# Altium schematic sheet debug_and_interface.SchDoc: Debugging / User Interface
size A4; DrawnBy: Juan I Carrano; DocumentNumber: 5; SheetNumber: 5; SheetTotal: 6
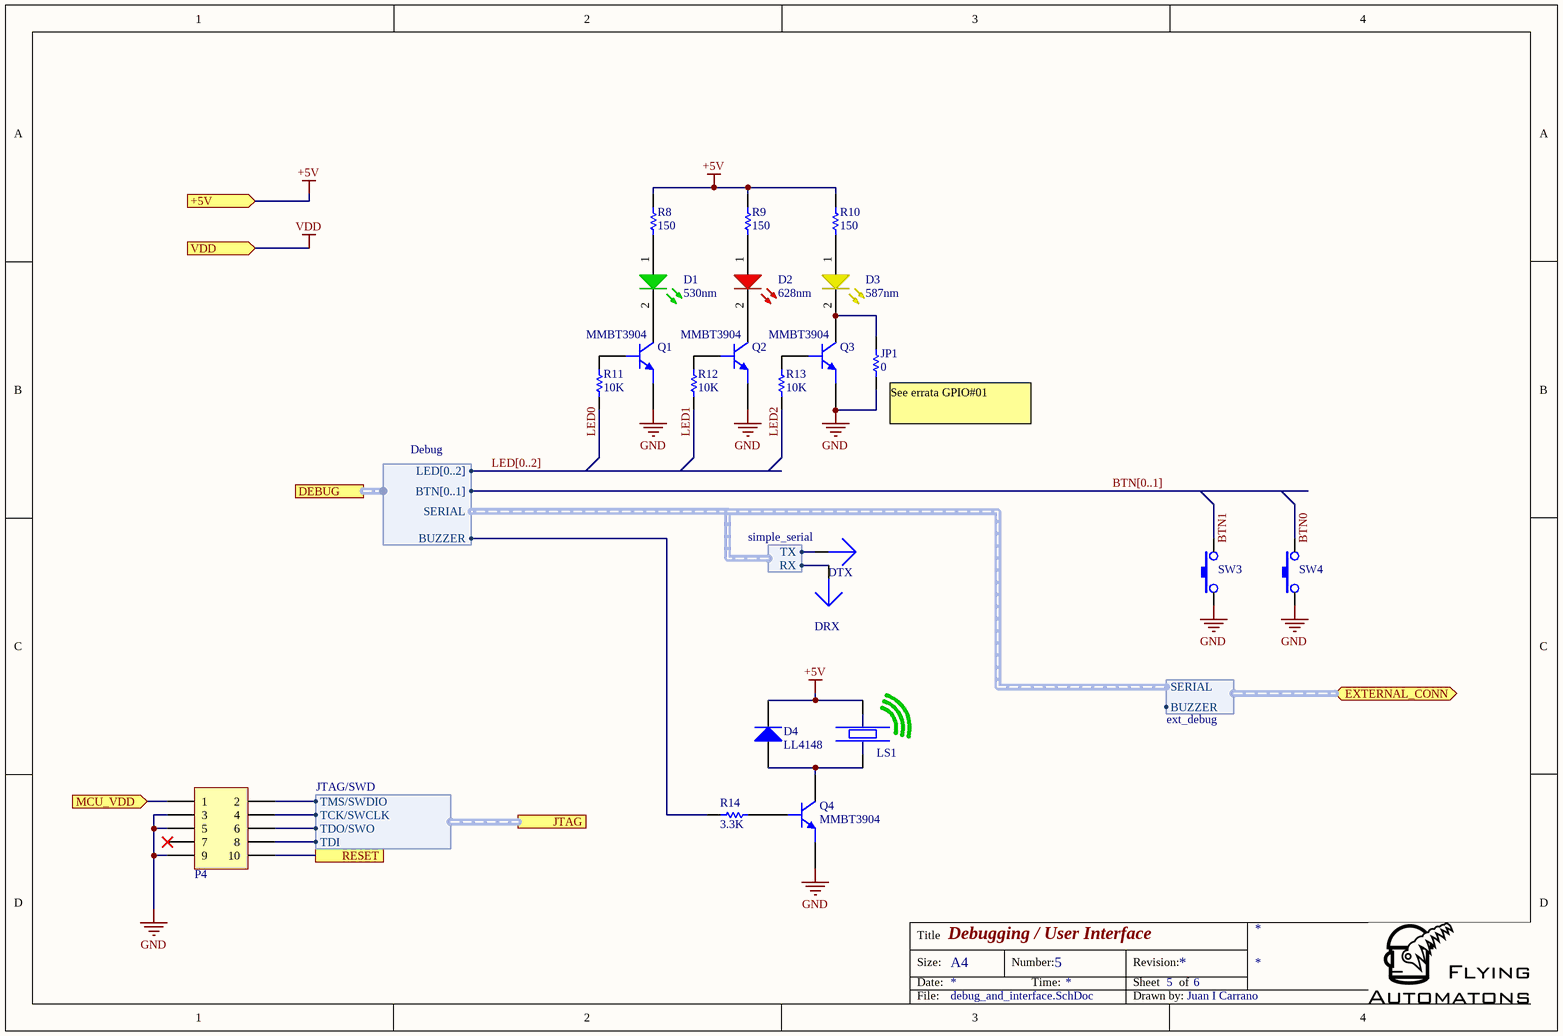
[diagram p0: debug_and_interface.SchDoc]

## Parts
D1  value 530nm  [DSO-F2/D3.4]  (hidden comment: LED-GREEN)
D2  value 628nm  [DSO-F2/D3.4]  (hidden comment: LED-RED)
D3  value 587nm  [DSO-F2/D3.4]  (hidden comment: LED-YELLOW)
D4  value LL4148  [SOD-80]  (hidden comment: DIODE)
DRX  TESTPOINT-ARROW-BLUE  [G-PIN_1mm-CIRCLE]  (value not drawn)
DTX  TESTPOINT-ARROW-BLUE  [G-PIN_1mm-CIRCLE]  (value not drawn)
JP1  0  [RESC1608L]
LS1  (no value)  [TWO_WIRE_HOLE_M0.9D3P]
P4  HEADER-5x2S  [G-HEADER_5x2I.05P_SM]  (value not drawn)
Q1  value MMBT3904  [SOT23-3L]  (hidden comment: BJT-NPN-BEC)
Q2  value MMBT3904  [SOT23-3L]  (hidden comment: BJT-NPN-BEC)
Q3  value MMBT3904  [SOT23-3L]  (hidden comment: BJT-NPN-BEC)
Q4  value MMBT3904  [SOT23-3L]  (hidden comment: BJT-NPN-BEC)
R8  150  [RESC1608L]
R9  150  [RESC1608L]
R10  150  [RESC1608L]
R11  10K  [RESC1608L]
R12  10K  [RESC1608L]
R13  10K  [RESC1608L]
R14  3.3K  [RESC1608L]
SW3  SWITCH_TACTILE_SPST-2T-NO  [G-SWITCH-M7.1x6.6AS3.25-2T_TH]  (value not drawn)
SW4  SWITCH_TACTILE_SPST-2T-NO  [G-SWITCH-M7.1x6.6AS3.25-2T_TH]  (value not drawn)

## Ports
+5V (in), DEBUG (harness Debug), EXTERNAL_CONN (harness ext_debug), JTAG (harness JTAG/SWD), MCU_VDD (in), RESET, VDD (in)

## Harnesses
simple_serial: RX, TX
JTAG/SWD: TCK/SWCLK, TDI, TDO/SWO, TMS/SWDIO
Debug: SERIAL, BTN[0..1], BUZZER, LED[0..2]
ext_debug: BUZZER, SERIAL

## Nets
+5V: D4.2(K) LS1.1 R8.1 R9.1 R10.1 ; port +5V
GND: JP1.2 P4.3 P4.5 P4.9 Q1.2(E) Q2.2(E) Q3.2(E) Q4.2(E) SW3.1 SW4.1
VDD: port VDD
BTN0: SW4.2
BTN1: SW3.2
LED0: R11.2
LED1: R12.2
LED2: R13.2
MCU_VDD: P4.1 ; port MCU_VDD
RESET: P4.10 ; port RESET
NetD1_1: D1.1(A) R8.2
NetD1_2: D1.2(K) Q1.3(C)
NetD2_1: D2.1(A) R9.2
NetD2_2: D2.2(K) Q2.3(C)
NetD3_1: D3.1(A) R10.2
NetD3_2: D3.2(K) JP1.1 Q3.3(C)
NetD4_1: D4.1(A) LS1.2 Q4.3(C)
NetDRX_1: DRX.1 ; harness simple_serial.RX
NetDTX_1: DTX.1 ; harness simple_serial.TX
NetP4_2: P4.2 ; port JTAG.TMS/SWDIO
NetP4_4: P4.4 ; port JTAG.TCK/SWCLK
NetP4_6: P4.6 ; port JTAG.TDO/SWO
NetP4_8: P4.8 ; port JTAG.TDI
NetQ1_1: Q1.1(B) R11.1
NetQ2_1: Q2.1(B) R12.1
NetQ3_1: Q3.1(B) R13.1
NetQ4_1: Q4.1(B) R14.1
NetR14_2: R14.2 ; port DEBUG.BUZZER

Not connected (* = marked no-connect by the designer): P4 7*

## Buses and harness runs
bus BTN[0..1]
bus LED[0..2]

## Notes on the sheet
- (near JP1) See errata GPIO#01
- Title
- Size:
- Date:
- A4
- Number:
- Time:
- Revision:
- Sheet
- of
- File:
- Drawn by:

## Library data of the parts
D1 = LED_GREEN_0603_530: LED CHIPLED 570NM GREEN 0603 SMD; Manufacturer: OSRAM Opto Semiconductors Inc; Manufacturer Part Number: LG Q971-KN-1; Drawn By: Juan I Carrano; Name: LED_GREEN_0603_530; Supplier 1: Digi-Key; Supplier Part Number 1: 475-1409-1-ND
D2 = LED_RED_0603_628: LED POINTLED 628NM SUPER RED SMD; Manufacturer: OSRAM Opto Semiconductors Inc; Manufacturer Part Number: LS Q971-KN-1; Drawn By: Juan I Carrano; Name: LED_RED_0603_628; Supplier 1: Digi-Key; Supplier Part Number 1: 475-3016-1-ND
D3 = LED_YELLOW_0603_587: LED CHIPLED 587NM YLW 0603 SMD; Manufacturer: OSRAM Opto Semiconductors Inc; Manufacturer Part Number: LY Q976-P1S2-36; Drawn By: Juan I Carrano; Name: LED_YELLOW_0603_587; Supplier 1: Digi-Key; Supplier Part Number 1: 475-2558-1-ND
D4 = LL4148: DIODE SMALL SIG 100V 0.2A SOD80; Manufacturer: Fairchild Semiconductor; Drawn By: Juan I Carrano; Name: LL4148; Manufacturer Part Number: LL4148; Supplier 1: Digi-Key; Supplier Part Number 1: LL4148FSCT-ND
DRX DTX = TESTP_SIG_1mm: Tespoint; Name: TESTP_SIG_1mm
JP1 = RES_0_0603_0W1_1%: RES 0.0 OHM 1/10W JUMP 0603; Manufacturer Part Number: RC1608J000CS; Name: RES_0_0603_0W1_1%; Value: 0; Supplier 1: Digi-Key; Supplier Part Number 1: 1276-3510-1-ND
LS1 = PIEZO_BUZZER_EXT: Piezoelectric buzzer (soldered wire); Drawn By: Juan I Carrano; Name: PIEZO_BUZZER_EXT
P4 = HEADER_5x2_50mil_U: CONN HEADER 10POS DL UNSHRD SMD; Name: HEADER_5x2_50mil_U
Q1-Q4 = MMBT3904: TRANSISTOR NPN 40V 0.2A SOT23; Manufacturer: NXP Semiconductors; Name: MMBT3904; Manufacturer Part Number: MMBT3904; Supplier 1: Digi-Key; Supplier Part Number 1: 568-4510-1-ND
R8-R10 = RES_150_0603_0W1_1%: RES 150 OHM 1/10W 1% 0603 SMD; Manufacturer: Rohm Semiconductor; Manufacturer Part Number: MCR03ERTF1500; Name: RES_150_0603_0W1_1%; Value: 150; Supplier 1: Digi-Key; Supplier Part Number 1: RHM150CFCT-ND
R11-R13 = RES_10K_0603_0W1_1%: RES 10K OHM 1/10W 5% 0603; Manufacturer Part Number: RC1608J103CS; Name: RES_10K_0603_0W1_1%; Value: 10K; Supplier 1: Digi-Key; Supplier Part Number 1: 1276-5086-1-ND
R14 = RES_3K3_0603_0W1_1%: RES 3.3K OHM 1/10W 1% 0603 SMD; Manufacturer: Rohm Semiconductor; Manufacturer Part Number: MCR03ERTF3301; Name: RES_3K3_0603_0W1_1%; Value: 3.3K; Supplier 1: Digi-Key; Supplier Part Number 1: RHM3.30KCFCT-ND
SW3 SW4 = SW_TACT_7.1x6.6mm_S_A5_TH: SWITCH TACTILE SPST-NO 0.05A 12V; Manufacturer: TE Connectivity; Manufacturer Part Number: 1825027-8; Name: SW_TACT_7.1x6.6mm_S_A5_TH; Supplier 1: Digi-Key; Supplier Part Number 1: 450-1657-ND